# Altium project InsaneKeyboard-R.PrjPcb (part 3 of 6)
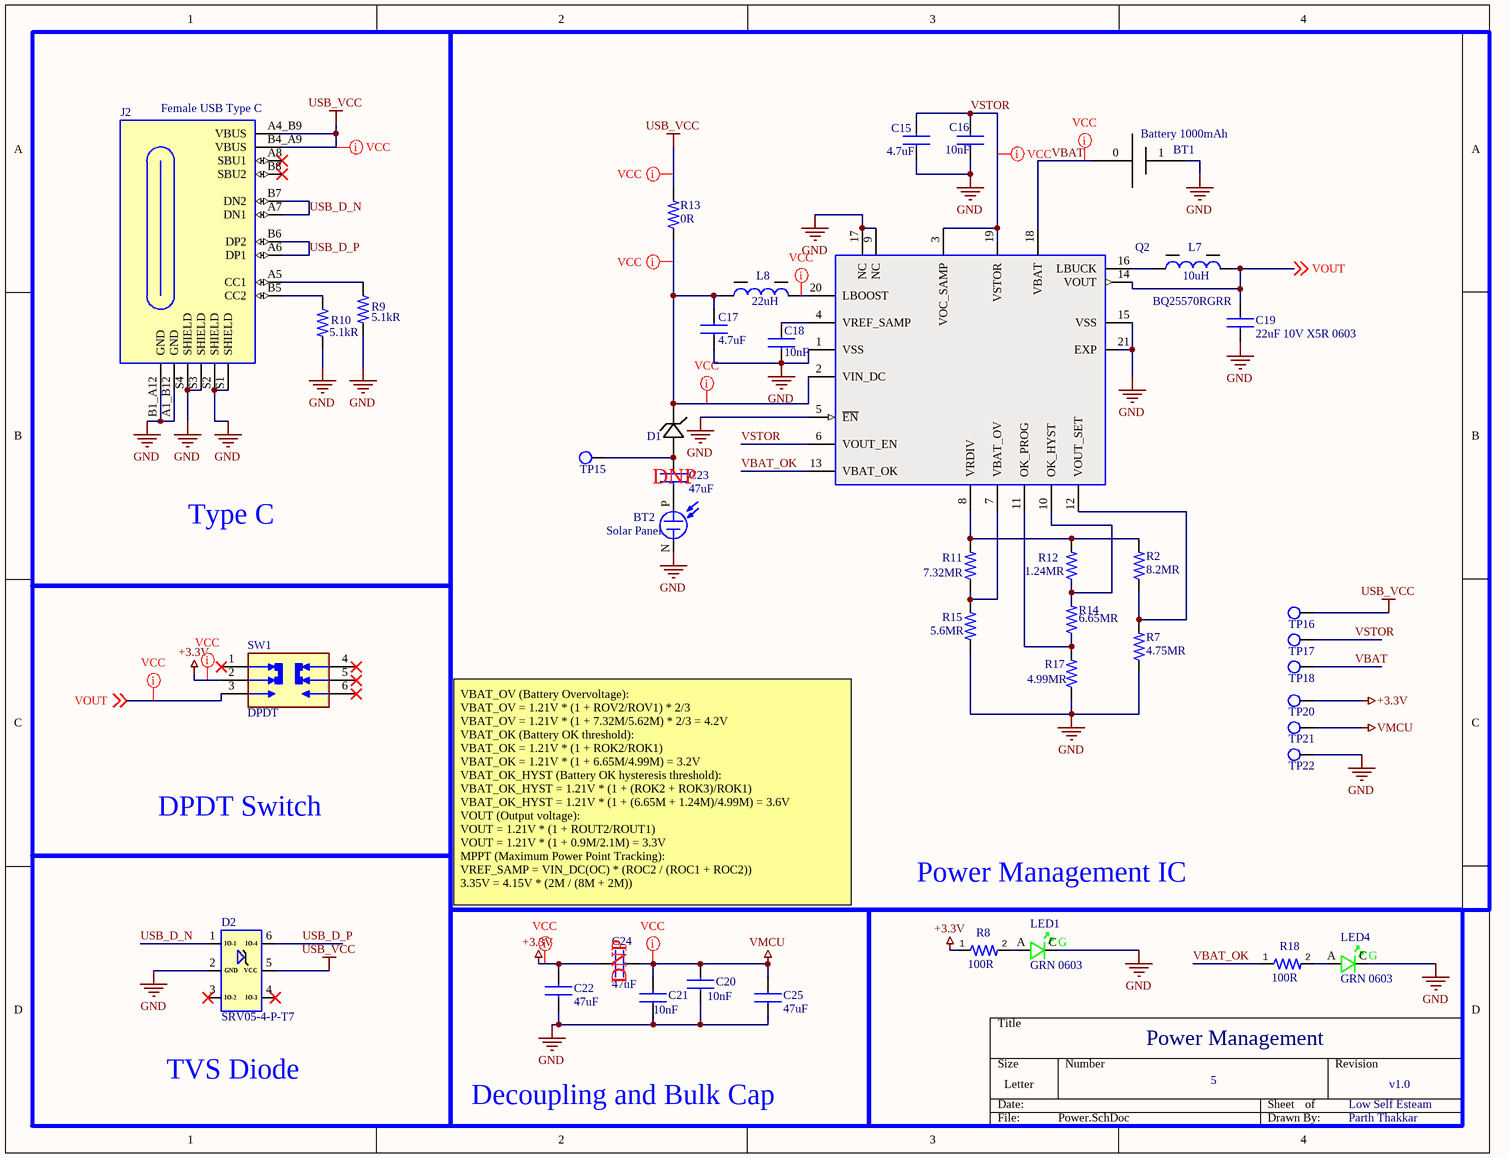
[diagram p9: Power.SchDoc]

## Sheet Power.SchDoc: Power Management (continued)

### Library data of the parts (continued)
R17 = RES 4.99M 0603: Fixed Resistor, Metal Glaze/thick Film, 0.1W, 4990000ohm, 75V, 1% +/-Tol, 100ppm/Cel, Surface Mount, 0603; Manufacturer: Yageo; Manufacturer Part Number: RC0603FR-074M99L; Additional Feature: LASER TRIMMABLE; Power: 100mW; Rated Temperature: 70°C; Temperature Coefficient: 100ppm/°C; Package Height: 0.45mm; Package Length: 1.6mm; Package Width: 0.8mm; Supplier: Digikey; Supplier Part Number: 13-RC0603FR-074M99LDKR-ND; RoHS: Yes; Category: Chip SMD Resistors; Stock: 585; Pricing: 1=0.1, 10=0.019, 50=0.0112, 100=0.0093, 500=0.00622, 1000=0.00532 (USD); Mounting Technology: Surface Mount; Pins: 2; Package Shape: Rectangular; Case/Package: 0603; Terminal Finish: Nickel; Min Operating Temperature: -55°C; Max Operating Temperature: 155°C; Tolerance: 1%; JESD-609 Code: e3; Resistor Type: FIXED RESISTOR; Construction: Chip; Package Style: SMTMeter; Packaging: Tape and Reel; Technology: METAL GLAZE/THICK FILM; Termination: Wraparound; Working Voltage: 75V; Reach SVHC Compliant: Yes; RoHS Compliant: Yes; ComponentLink1URL: https://datasheet.ciiva.com:443/pdfs/VipMasterIC/IC/YAGO/YAGO-S-A0008145938/YAGO-S-A0008145938-1.pdf?src-supplier=IHS+Markit; ComponentLink1Description: https://datasheet.ciiva.com:443/pdfs/VipMasterIC/IC/YAGO/YAGO-S-A0008145938/YAGO-S-A0008145938-1.pdf?src-supplier=IHS+Markit; ComponentLink2URL: http://www.mouser.com/ds/2/447/RC0603-272842.pdf?src-supplier=Mouser; ComponentLink2Description: http://www.mouser.com/ds/2/447/RC0603-272842.pdf?src-supplier=Mouser; ComponentLink3URL: http://www.yageo.com/documents/recent/PYu-RC_Group_51_RoHS_L_9.pdf?src-supplier=Digikey; ComponentLink3Description: http://www.yageo.com/documents/recent/PYu-RC_Group_51_RoHS_L_9.pdf?src-supplier=Digikey; ComponentLink4URL: http://www.yageo.com/documents/recent/PYu-RC0603_51_RoHS_L_7.pdf?src-supplier=Future+Electronics; ComponentLink4Description: http://www.yageo.com/documents/recent/PYu-RC0603_51_RoHS_L_7.pdf?src-supplier=Future+Electronics; ComponentLink5URL: http://www.yageo.com/documents/recent/PYu-RC_Group_51_RoHS_L_2.pdf?src-supplier=Avnet; ComponentLink5Description: http://www.yageo.com/documents/recent/PYu-RC_Group_51_RoHS_L_2.pdf?src-supplier=Avnet; ComponentLink6URL: https://datasheet.octopart.com/RC0603FR-074M99L-Yageo-datasheet-164759695.pdf?src-supplier=Future+Electronics; ComponentLink6Description: https://datasheet.octopart.com/RC0603FR-074M99L-Yageo-datasheet-164759695.pdf?src-supplier=Future+Electronics; ComponentLink7URL: https://datasheet.octopart.com/RC0603FR-074M99L-Yageo-datasheet-148775077.pdf?src-supplier=TME; ComponentLink7Description: https://datasheet.octopart.com/RC0603FR-074M99L-Yageo-datasheet-148775077.pdf?src-supplier=TME
SW1 = DPDT: Slide Switch, DPDT, Latched, Solder Terminal, Through Hole-right Angle; Manufacturer: E-Switch; Manufacturer Part Number: EG2208; Body Breadth: 6inch; Body Height: 5mm; Body Length or Diameter: 10mm; Supplier: Digikey; Supplier Part Number: EG1941-ND; RoHS: Yes; Category: Slide Switches; Stock: 171516; Pricing: 1=0.66, 10=0.639, 25=0.5968, 100=0.5183, 250=0.47168, 800=0.43728, 1600=0.4325 (USD); Mounting Technology: Through Hole; Terminal Finish: Silver; Min Operating Temperature: -20°C; Max Operating Temperature: 70°C; JESD-609 Code: e4; Switch Action: LATCHED; Switch Function: DPDT; Switch Type: Slide Switch; Termination: Solder; Reach SVHC Compliant: Yes; RoHS Compliant: Yes; ComponentLink1URL: https://datasheet.ciiva.com:443/pdfs/VipMasterIC/IC/ESCH/ESCH-S-A0005350660/ESCH-S-A0005350660-1.pdf?src-supplier=IHS+Markit; ComponentLink1Description: https://datasheet.ciiva.com:443/pdfs/VipMasterIC/IC/ESCH/ESCH-S-A0005350660/ESCH-S-A0005350660-1.pdf?src-supplier=IHS+Markit; ComponentLink2URL: https://datasheet.ciiva.com/2889/p040110c-2889382.pdf?src-supplier=Digikey; ComponentLink2Description: https://datasheet.ciiva.com/2889/p040110c-2889382.pdf?src-supplier=Digikey; ComponentLink3URL: https://datasheet.ciiva.com/16174/seriesegslides-16174287.pdf?src-supplier=Onlinecomponents.com; ComponentLink3Description: https://datasheet.ciiva.com/16174/seriesegslides-16174287.pdf?src-supplier=Onlinecomponents.com; ComponentLink4URL: https://datasheet.ciiva.com/16216/eg-16216332.pdf?src-supplier=Future+Electronics; ComponentLink4Description: https://datasheet.ciiva.com/16216/eg-16216332.pdf?src-supplier=Future+Electronics
TP15 = Test Point: Test points